# EAGLE design TPS709XX_30V_to_1V8 (EAGLE 7.2.0)
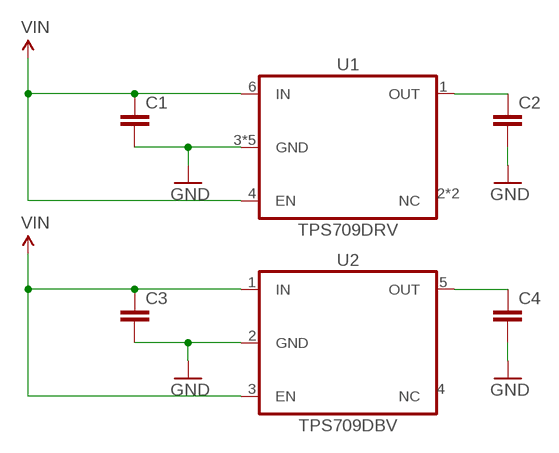
[diagram p0: schematic, sheet 1]

## Parts
C1  C-EUC0402  [C0402]
C2  C-EUC0402  [C0402]
C3  C-EUC0603  [C0603]
C4  C-EUC0603  [C0603]
U1  TPS709DRV  [DRV]
U2  TPS709DBV  [DBV]

## Nets
GND: C1.2 C2.2 C3.2 C4.2 U1.3(GND) U1.7(GND) U1.8(GND) U1.V1(GND) U1.V2(GND) U2.2(GND)
VIN: C1.1 C3.1 U1.4(EN) U1.6(IN) U2.1(IN) U2.3(EN)
VOUT1: C2.1 U1.1(OUT)
VOUT2: C4.1 U2.5(OUT)
Unconnected: U1.2(NC) U1.5(NC) U2.4(NC)

## Library data of the parts
C1-C4 = rcl:C-EU: CAPACITOR, European symbol
U1 U2 = 1V8:TPS709*

## Board
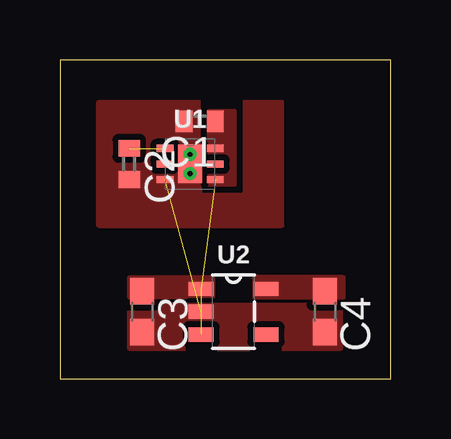
[diagram p1: board, top side]
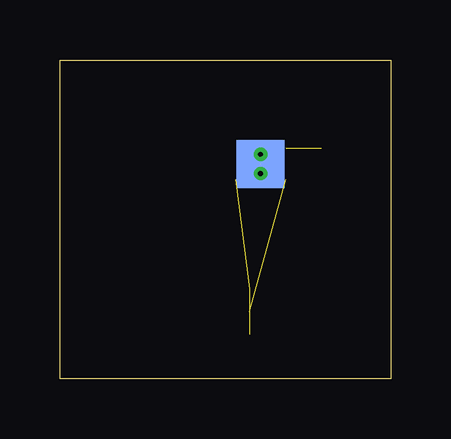
[diagram p2: board, bottom side, seen from below]

Size 13.8 x 13.31 mm. Coordinates in mm from the lower left corner, seen from the top.
Outline: 0,0 13.8,0 13.8,13.31 0,13.31 0,0
Copper layers (1*16): Top 0.0356mm / dielectric 1.5011mm / Bottom 0.0356mm
Design rules "oshpark-2layer": minimum track width 6mil, minimum drill 13mil, track to track 6mil, track to pad 6mil, pad to pad 6mil, via to via 6mil, smd to smd 6mil, copper to edge 15mil, drill to drill 6mil, minimum pad ring 7mil, minimum via ring 7mil, stop-mask expansion 4mil, vias tented up to drill 0mil, thermal gap 10mil

### Footprints (pad centres in the part's own frame; a part is rotated, then mirrored left to right if it is on the bottom)
C0402 = smd 0.7 x 0.9: 1 -0.65,0; 2 0.65,0
C0603 = smd 1.1 x 1: 1 -0.85,0; 2 0.85,0
DRV = smd 0.7 x 0.3: 1 -1.05,0.65; 2 -1.05,0; 3 -1.05,-0.65; 4 1.05,-0.65; 5 1.05,0; 6 1.05,0.65 | smd 1 x 1.6: 7 0,0 | smd 2 x 2 bottom: 8 0,0 | drill 0.2 pad 0.254: V1 0,0.4; V2 0,-0.4
DBV = smd 1.05 x 0.6: 1 -1.35,0.95; 2 -1.35,0; 3 -1.35,-0.95; 4 1.35,-0.95; 5 1.35,0.95

### Placement (x,y rotation side)
C1  5.83,10.75 180 top
C2  2.89,8.97 270 top
C3  3.43,2.81 270 top
C4  11.05,2.81 270 top
U1  5.43,8.97 0 top
U2  7.24,2.81 0 top

### Tracks (layer width: path | path; a pad name or v marks a point on that pad's centre or on a via)
GND  (2 unrouted)
  pour Top (isolate 0.254, no thermals): 2.92,3.06 11.69,3.06 11.69,1.29 2.92,1.29
  pour Top (isolate 0.254, rank 2, no thermals): 1.62,11.51 1.62,6.43 9.24,6.43 9.24,11.51
VIN  (2 unrouted)
  pour Top (isolate 0.254, no thermals): 6.35,3.44 2.92,3.44 2.92,4.21 6.35,4.21
  pour Top (isolate 0.254, no thermals): 6.2,11.2 6.2,8.1 7.3,8.1 7.3,11.2
VOUT1  (1 unrouted)
VOUT2
  pour Top (isolate 0.254, no thermals): 8.13,3.44 11.81,3.44 11.81,4.21 8.13,4.21